# Altium schematic sheet DiPho_digital.SchDoc: DiPho digital
size 420 x 297 mm; Author: P. Daniel; CompanyName: WUT ISE; DrawnBy: P. Daniel; Organization: WUT ISE; Address1: WUT ISE; Address2: Nowowiejska 15/19 00-665 Warsaw; Address3: piotrmaciejdaniel@gmail.com; Revision: 1; SheetNumber: 1; SheetTotal: 4; ModifiedBy: -; CreateDate: 10-12.2021; CheckedDate: -; Title2: top schematic; DivGrp: WUT ISE; Designer: Piotr Daniel
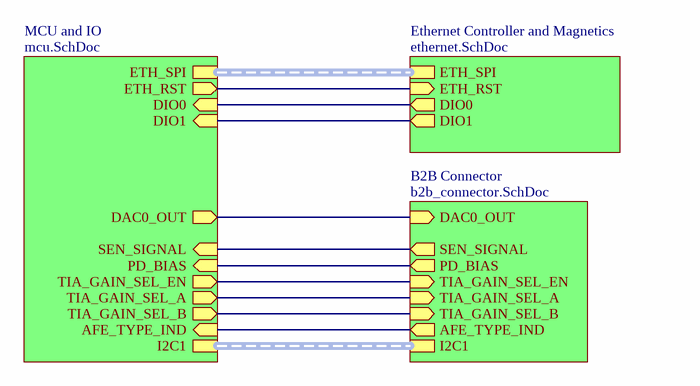
[diagram p0: DiPho_digital.SchDoc]

## Sub-sheets
B2B Connector = b2b_connector.SchDoc: I2C1 (harness I2C), AFE_TYPE_IND (out), TIA_GAIN_SEL_B (in), TIA_GAIN_SEL_A (in), PD_BIAS (out), SEN_SIGNAL (out), DAC0_OUT (in), TIA_GAIN_SEL_EN (in)
Ethernet Controller and Magnetics = ethernet.SchDoc: ETH_SPI (harness ETH_SPI), ETH_RST (in), DIO0 (out), DIO1 (out)
MCU and IO = mcu.SchDoc: I2C1 (harness I2C), ETH_SPI (harness ETH_SPI), ETH_RST (out), AFE_TYPE_IND (in), TIA_GAIN_SEL_A (out), PD_BIAS (in), DAC0_OUT (out), TIA_GAIN_SEL_B (out), TIA_GAIN_SEL_EN (out), SEN_SIGNAL (in), DIO0 (in), DIO1 (in)

## Nets
(unnamed): sheet MCU and IO/ETH_RST, sheet Ethernet Controller and Magnetics/ETH_RST
(unnamed): sheet MCU and IO/AFE_TYPE_IND, sheet B2B Connector/AFE_TYPE_IND
(unnamed): sheet MCU and IO/TIA_GAIN_SEL_A, sheet B2B Connector/TIA_GAIN_SEL_A
(unnamed): sheet MCU and IO/PD_BIAS, sheet B2B Connector/PD_BIAS
(unnamed): sheet MCU and IO/DAC0_OUT, sheet B2B Connector/DAC0_OUT
(unnamed): sheet MCU and IO/TIA_GAIN_SEL_B, sheet B2B Connector/TIA_GAIN_SEL_B
(unnamed): sheet MCU and IO/TIA_GAIN_SEL_EN, sheet B2B Connector/TIA_GAIN_SEL_EN
(unnamed): sheet MCU and IO/SEN_SIGNAL, sheet B2B Connector/SEN_SIGNAL
(unnamed): sheet MCU and IO/DIO0, sheet Ethernet Controller and Magnetics/DIO0
(unnamed): sheet MCU and IO/DIO1, sheet Ethernet Controller and Magnetics/DIO1

## Buses and harness runs
harness sheet B2B Connector/I2C1 = sheet MCU and IO/I2C1
harness sheet Ethernet Controller and Magnetics/ETH_SPI = sheet MCU and IO/ETH_SPI

## Notes on the sheet
- Project/Equipment
- Document
- Designer
- Drawn by
- Check.by
- Copyright WUT ISE 2021.
  This documentation describes Open Hardware and is licensed under the CERN OHL v.1.1. You may redistribute and modify this documentation under the terms of the CERN OHL v.1.1. (http://ohwr.org/CERNOHL). This documentation is distributed WITHOUT ANY EXPRESS OR IMPLIED WARRANTY, INCLUDING OF MERCHANTABILITY, SATISFACTORY QUALITY AND FITNESS FOR A PARTICULAR PURPOSE. Please see the CERN OHL v.1.1 for applicable conditions.
- Contact
- File
- Last Mod.
- Print Date
- Sheet
- Size
- A3
- of
- Rev